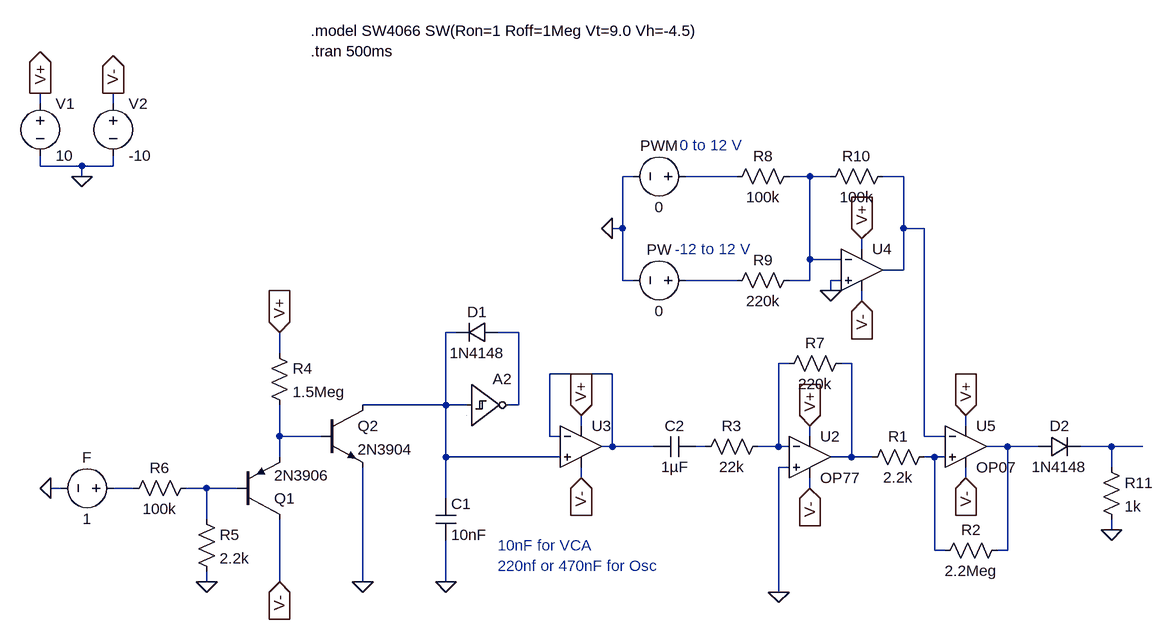
[diagram p0: schematic oscillator.asc]
oscillator.asc, the LTspice schematic file:
Version 4
SHEET 1 1560 1752
WIRE -704 176 -704 160
WIRE -592 176 -592 160
WIRE -704 272 -704 256
WIRE -640 272 -704 272
WIRE -592 272 -592 256
WIRE -592 272 -640 272
WIRE -640 288 -640 272
WIRE 208 288 192 288
WIRE 368 288 288 288
WIRE 480 288 448 288
WIRE 512 288 480 288
WIRE 624 288 592 288
WIRE 192 368 192 288
WIRE 192 368 176 368
WIRE 624 368 624 288
WIRE 656 368 624 368
WIRE 560 400 560 384
WIRE 480 416 480 288
WIRE 528 416 480 416
WIRE 624 432 624 368
WIRE 624 432 592 432
WIRE 192 448 192 368
WIRE 208 448 192 448
WIRE 368 448 288 448
WIRE 480 448 480 416
WIRE 480 448 448 448
WIRE 528 448 512 448
WIRE 512 464 512 448
WIRE 560 480 560 464
WIRE -64 528 -80 528
WIRE 32 528 0 528
WIRE -336 560 -336 528
WIRE 448 576 432 576
WIRE 544 576 528 576
WIRE 176 592 80 592
WIRE -80 640 -80 528
WIRE -80 640 -208 640
WIRE -48 640 -80 640
WIRE 32 640 32 528
WIRE 32 640 16 640
WIRE 128 672 128 656
WIRE 720 672 720 656
WIRE -336 688 -336 640
WIRE -272 688 -336 688
WIRE 80 688 80 592
WIRE 96 688 80 688
WIRE 480 688 480 672
WIRE 656 688 656 368
WIRE 688 688 656 688
WIRE 176 704 176 592
WIRE 176 704 160 704
WIRE 240 704 176 704
WIRE 320 704 304 704
WIRE 432 704 432 576
WIRE 432 704 400 704
WIRE 448 704 432 704
WIRE 784 704 752 704
WIRE 832 704 784 704
WIRE 944 704 896 704
WIRE 992 704 944 704
WIRE -336 720 -336 688
WIRE -80 720 -80 640
WIRE 96 720 -80 720
WIRE 544 720 544 576
WIRE 544 720 512 720
WIRE 576 720 544 720
WIRE 672 720 656 720
WIRE 688 720 672 720
WIRE 448 736 432 736
WIRE 944 736 944 704
WIRE 128 752 128 736
WIRE 720 752 720 736
WIRE -672 768 -688 768
WIRE -560 768 -592 768
WIRE -448 768 -480 768
WIRE -400 768 -448 768
WIRE 480 768 480 752
WIRE -80 784 -80 720
WIRE -448 816 -448 768
WIRE 944 832 944 816
WIRE 672 864 672 720
WIRE 688 864 672 864
WIRE 784 864 784 704
WIRE 784 864 768 864
WIRE -448 912 -448 896
WIRE -336 912 -336 816
WIRE -208 912 -208 736
WIRE -80 912 -80 848
WIRE 432 928 432 736
FLAG -592 160 V-
IOPIN -592 160 Out
FLAG -704 160 V+
IOPIN -704 160 Out
FLAG -640 288 0
FLAG -80 912 0
FLAG -208 912 0
FLAG -336 912 V-
IOPIN -336 912 In
FLAG -336 528 V+
IOPIN -336 528 In
FLAG -448 912 0
FLAG -688 768 0
FLAG 128 752 V-
IOPIN 128 752 In
FLAG 128 656 V+
IOPIN 128 656 In
FLAG 480 768 V-
IOPIN 480 768 In
FLAG 480 672 V+
IOPIN 480 672 In
FLAG 432 928 0
FLAG 720 752 V-
IOPIN 720 752 In
FLAG 720 656 V+
IOPIN 720 656 In
FLAG 176 368 0
FLAG 560 480 V-
IOPIN 560 480 In
FLAG 560 384 V+
IOPIN 560 384 In
FLAG 512 464 0
FLAG 944 832 0
SYMBOL voltage -704 160 R0
SYMATTR InstName V1
SYMATTR Value 10
SYMBOL voltage -592 160 R0
SYMATTR InstName V2
SYMATTR Value -10
SYMBOL Digital/schmtinv -48 576 R0
WINDOW 3 8 54 Left 2
SYMATTR InstName A2
SYMATTR SpiceLine VHigh=10 Vt=4.9 Vh=1.0 Trise=0.01ns Tfall=0.01ns
SYMBOL cap -96 784 R0
SYMATTR InstName C1
SYMATTR Value 10nF
SYMBOL pnp -400 816 M180
SYMATTR InstName Q1
SYMATTR Value 2N3906
SYMBOL npn -272 640 R0
SYMATTR InstName Q2
SYMATTR Value 2N3904
SYMBOL res -352 544 R0
SYMATTR InstName R4
SYMATTR Value 1.5Meg
SYMBOL res -464 800 R0
SYMATTR InstName R5
SYMATTR Value 2.2k
SYMBOL res -464 752 R90
WINDOW 0 0 56 VBottom 2
WINDOW 3 32 56 VTop 2
SYMATTR InstName R6
SYMATTR Value 100k
SYMBOL voltage -576 768 R90
WINDOW 0 -32 56 VBottom 2
WINDOW 3 32 56 VTop 2
SYMATTR InstName F
SYMATTR Value 1
SYMBOL diode 0 512 R90
WINDOW 0 0 32 VBottom 2
WINDOW 3 32 32 VTop 2
SYMATTR InstName D1
SYMATTR Value 1N4148
SYMBOL cap 304 688 R90
WINDOW 0 0 32 VBottom 2
WINDOW 3 32 32 VTop 2
SYMATTR InstName C2
SYMATTR Value 1µF
SYMBOL res 416 688 R90
WINDOW 0 0 56 VBottom 2
WINDOW 3 32 56 VTop 2
SYMATTR InstName R3
SYMATTR Value 22k
SYMBOL res 544 560 R90
WINDOW 0 0 56 VBottom 2
WINDOW 3 32 56 VTop 2
SYMATTR InstName R7
SYMATTR Value 220k
SYMBOL OpAmps/UniversalOpAmp 128 704 R0
SYMATTR InstName U3
SYMBOL res 672 704 R90
WINDOW 0 0 56 VBottom 2
WINDOW 3 32 56 VTop 2
SYMATTR InstName R1
SYMATTR Value 2.2k
SYMBOL res 784 848 R90
WINDOW 0 0 56 VBottom 2
WINDOW 3 32 56 VTop 2
SYMATTR InstName R2
SYMATTR Value 2.2Meg
SYMBOL Voltage 304 288 R90
WINDOW 0 -32 56 VBottom 2
WINDOW 3 32 56 VTop 2
SYMATTR InstName PWM
SYMATTR Value 0
SYMBOL Voltage 304 448 R90
WINDOW 0 -32 56 VBottom 2
WINDOW 3 32 56 VTop 2
SYMATTR InstName PW
SYMATTR Value 0
SYMBOL Res 464 272 R90
WINDOW 0 0 56 VBottom 2
WINDOW 3 32 56 VTop 2
SYMATTR InstName R8
SYMATTR Value 100k
SYMBOL Res 464 432 R90
WINDOW 0 0 56 VBottom 2
WINDOW 3 32 56 VTop 2
SYMATTR InstName R9
SYMATTR Value 220k
SYMBOL OpAmps/UniversalOpAmp 560 432 R0
SYMATTR InstName U4
SYMBOL Res 608 272 R90
WINDOW 0 0 56 VBottom 2
WINDOW 3 32 56 VTop 2
SYMATTR InstName R10
SYMATTR Value 100k
SYMBOL OpAmps/OP07 720 640 R0
SYMATTR InstName U5
SYMBOL diode 832 720 R270
WINDOW 0 32 32 VTop 2
WINDOW 3 0 32 VBottom 2
SYMATTR InstName D2
SYMATTR Value 1N4148
SYMBOL Res 928 720 R0
SYMATTR InstName R11
SYMATTR Value 1k
SYMBOL OpAmps/OP77 480 656 R0
SYMATTR InstName U2
TEXT -288 64 Left 2 !.model SW4066 SW(Ron=1 Roff=1Meg Vt=9.0 Vh=-4.5)\n.tran 500ms
TEXT 272 400 Left 2 ;-12 to 12 V
TEXT 280 240 Left 2 ;0 to 12 V
TEXT 0 856 Left 2 ;10nF for VCA\n220nf or 470nF for Osc

The netlist it stands for:
* oscillator.asc
V1 V+ 0 10
V2 V- 0 -10
A2 N005 0 0 0 0 N006 0 0 SCHMITT VHigh=10 Vt=4.9 Vh=1.0 Trise=0.01ns Tfall=0.01ns
C1 N005 0 10nF
Q1 V- N016 N010 0 2N3906
Q2 N005 N010 0 0 2N3904
R4 V+ N010 1.5Meg
R5 N016 0 2.2k
R6 N016 N015 100k
V§F N015 0 1
D1 N006 N005 1N4148
C2 N011 N009 1µF
R3 N007 N011 22k
R7 N008 N007 220k
XU3 N005 N009 V+ V- N009 level1 Avol=1Meg GBW=10Meg Vos=0 En=0 Enk=0 In=0 Ink=0 Rin=500Meg  ; pins In+ In- V+ V- OUT
R1 N014 N008 2.2k
R2 N012 N014 2.2Meg
V§PWM N001 0 0
V§PW N004 0 0
R8 N002 N001 100k
R9 N002 N004 220k
XU4 0 N002 V+ V- N003 level1 Avol=1Meg GBW=10Meg Vos=0 En=0 Enk=0 In=0 Ink=0 Rin=500Meg  ; pins In+ In- V+ V- OUT
R10 N003 N002 100k
XU5 N014 N003 V+ V- N012 LT1001  ; OP07, pins In+ In- V+ V- OUT
D2 N012 N013 1N4148
R11 N013 0 1k
XU2 0 N007 V+ V- N008 OP77  ; pins In+ In- V+ V- OUT
.model D D
.lib standard.dio
.model NPN NPN
.model PNP PNP
.lib standard.bjt
.model SW4066 SW(Ron=1 Roff=1Meg Vt=9.0 Vh=-4.5)
.tran 500ms
* -12 to 12 V
* 0 to 12 V
* 10nF for VCA
* 220nf or 470nF for Osc
.lib UniversalOpAmp1.lib
.lib LTC.lib
.lib ADI.lib
.backanno
.end